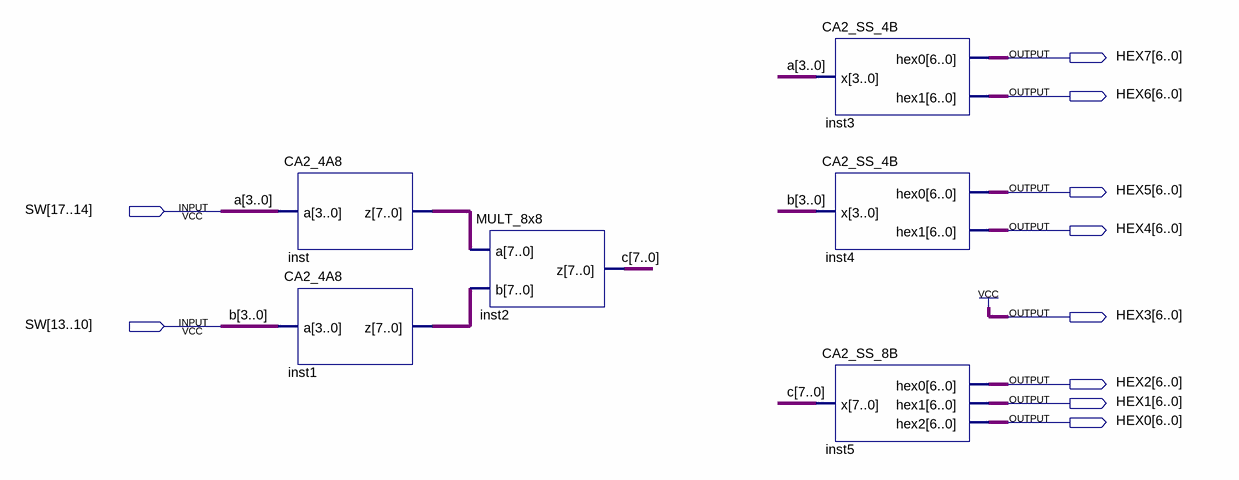
[diagram p0: schematic sheet]
// Quartus schematic MULT_CA2_BCD.bdf as structural Verilog: 6 symbols, 10 pins
module MULT_CA2_BCD (
  input  [17:10] SW,
  output [6:0] HEX7,
  output [6:0] HEX6,
  output [6:0] HEX5,
  output [6:0] HEX4,
  output [6:0] HEX3,
  output [6:0] HEX2,
  output [6:0] HEX1,
  output [6:0] HEX0
);

  wire [7:0] c, inst1_z, inst_z;

  CA2_4A8 inst (.a(SW[17:14]), .z(inst_z));
  CA2_4A8 inst1 (.a(SW[13:10]), .z(inst1_z));
  MULT_8x8 inst2 (.a(inst_z), .b(inst1_z), .z(c));
  CA2_SS_4B inst3 (.x(SW[17:14]), .hex0(HEX7), .hex1(HEX6));
  CA2_SS_4B inst4 (.x(SW[13:10]), .hex0(HEX5), .hex1(HEX4));
  CA2_SS_8B inst5 (.x(c), .hex0(HEX2), .hex1(HEX1), .hex2(HEX0));

  assign HEX3 = {7{1'b1}};

  // Other names for the same wires on the sheet: a[3:0] = SW[17:14]; b[3:0] = SW[13:10]
endmodule
